# EAGLE design Brakeout board - VEML7700 (EAGLE 9.6.2)
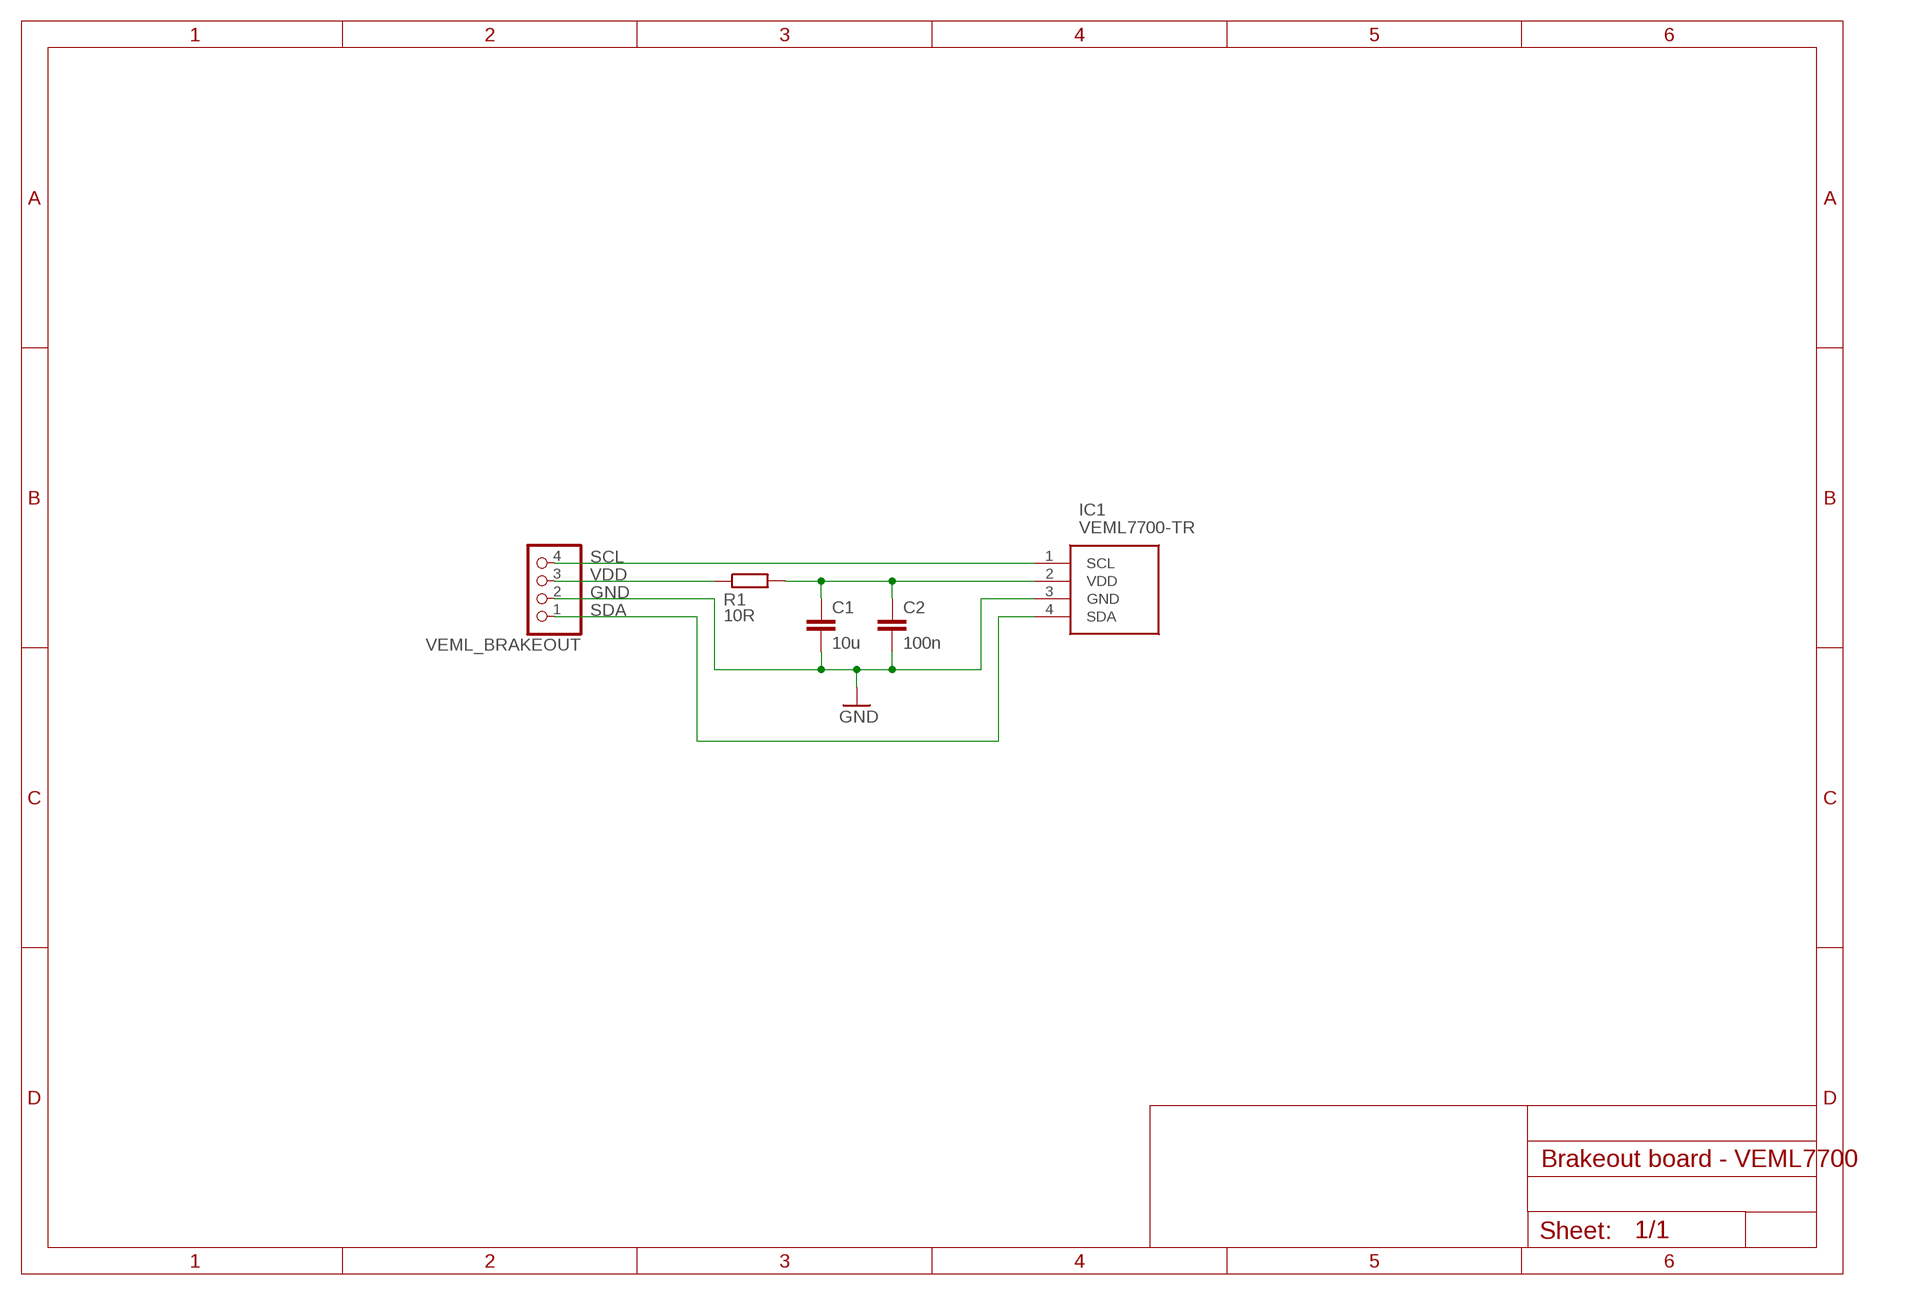
[diagram p0: schematic, sheet 1]

## Parts
C1  10u  C-EUC0603  [C0603]
C2  100n  C-EUC0603  [C0603]
IC1  VEML7700-TR  [VEML7700]
R1  10R  R-EU_R0603  [R0603]
VEML_BRAKEOUT  PINHD-1X4  [1X04]

## Nets
GND: C1.2 C2.2 IC1.3(GND) VEML_BRAKEOUT.2
N$2: C1.1 C2.1 IC1.2(VDD) R1.2
SCL: IC1.1(SCL) VEML_BRAKEOUT.4
SDA: IC1.4(SDA) VEML_BRAKEOUT.1
VDD: R1.1 VEML_BRAKEOUT.3

## Library data of the parts
C1 C2 = rcl:C-EU: CAPACITOR, European symbol; SPICEPREFIX: C
IC1 = 1-component-search:VEML7700-TR: High Accuracy Ambient Light Sensor with I2C Interface Source: Datasheet <http://www.vishay.com/docs/84286/veml7700.pdf>; ARROW_PART_NUMBER: VEML7700-TR; ARROW_PRICE-STOCK: https://www.arrow.com/en/products/veml7700-tr/vishay?region=nac; DESCRIPTION: High Accuracy Ambient Light Sensor with I2C Interface; HEIGHT: mm; MANUFACTURER_NAME: Vishay; MANUFACTURER_PART_NUMBER: VEML7700-TR; MOUSER_PART_NUMBER: 78-VEML7700-TR; MOUSER_PRICE-STOCK: https://www.mouser.co.uk/ProductDetail/Vishay-Semiconductors/VEML7700-TR?qs=BcfjnG7NVaWcZHs8m27pyQ%3D%3D
R1 = rcl:R-EU_: RESISTOR, European symbol; SPICEPREFIX: R
VEML_BRAKEOUT = pinhead:PINHD-1X4: PIN HEADER

## Board
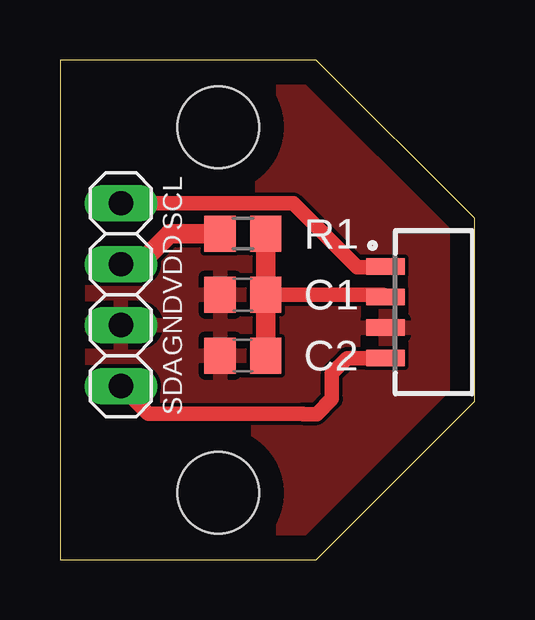
[diagram p1: board, top side]
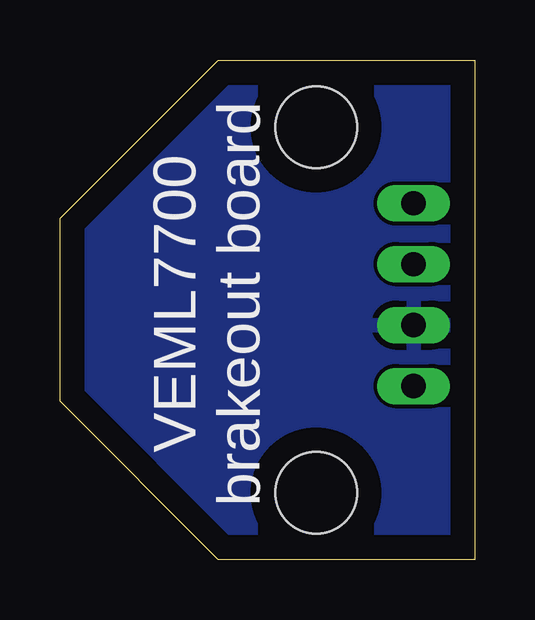
[diagram p2: board, bottom side, seen from below]

Size 17.27 x 20.83 mm. Coordinates in mm from the lower left corner, seen from the top.
Outline: 0,0 10.67,0 17.27,6.6 17.27,14.22 10.67,20.83 0,20.83 0,0
Copper layers (1*16): Top 0.035mm / dielectric 1.5mm / Bottom 0.035mm
Design rules "default": minimum track width 6mil, minimum drill 0.35mm, track to track 6mil, track to pad 6mil, pad to pad 6mil, via to via 6mil, smd to smd 6mil, copper to edge 40mil, drill to drill 6mil, minimum pad ring 10mil, minimum via ring 8mil, stop-mask expansion 4mil, vias tented up to drill 0mil, thermal gap 10mil
Holes 3.4 mm at 6.6,18.03 6.6,2.79

### Footprints (pad centres in the part's own frame; a part is rotated, then mirrored left to right if it is on the bottom)
C0805 = smd 1.3 x 1.5: 1 -0.95,0; 2 0.95,0
VEML7700 = smd 0.7 x 1.6: 1 1.495,-0.4; 2 2.765,-0.4; 3 4.035,-0.4; 4 5.305,-0.4
R0805 = smd 1.3 x 1.5: 1 -0.95,0; 2 0.95,0
1X04 = drill 1.016 long: 1 -3.81,0; 2 -1.27,0; 3 1.27,0; 4 3.81,0

### Placement (x,y rotation side)
C1  10u  [C0805]  7.62,11.05 180 top
C2  100n  [C0805]  7.62,8.51 180 top
IC1  13.97,13.72 270 top
R1  10R  [R0805]  7.62,13.59 0 top
VEML_BRAKEOUT  2.54,11.05 90 top

### Tracks (layer width: path | path; a pad name or v marks a point on that pad's centre or on a via)
GND
  pour Top: 0,-0.51 0,21.34 17.27,21.34 17.27,-0.51
  pour Bottom: 0,-0.51 0,21.34 17.27,21.34 17.27,-0.51
N$2
  Top 0.406: 13.47,11.05 IC1.2
  Top 0.61: C1.1 13.47,11.05
  Top 0.813: R1.2 C1.1 C2.1
SCL
  Top 0.406: 13.54,12.19 IC1.1
  Top 0.61: VEML_BRAKEOUT.4 9.71,14.86 12.38,12.19 13.54,12.19
SDA
  Top 0.152: 13.51,8.51 IC1.4
  Top 0.406: 10.12,6.1 10.14,6.07
  Top 0.61: VEML_BRAKEOUT.1 3.68,6.1 10.12,6.1 | 10.14,6.07 10.69,6.07 11.33,6.71 11.33,7.77 11.97,8.41 IC1.4
VDD
  Top 0.813: VEML_BRAKEOUT.3 3.3,12.32 4.57,13.59 R1.1

### Text on the board
tNames: SCL | VDD | GND | SDA
bNames: VEML7700 / brakeout board